# EAGLE schematic relay (EAGLE 6.4)
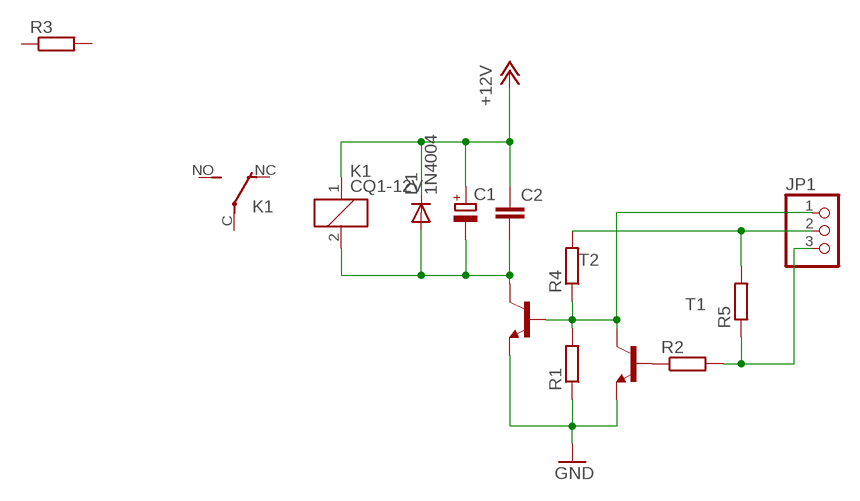
[diagram p0: schematic, sheet 1]

## Parts
C1  CPOL-EUE5-13  [E5-13]
C2  C-EU050-025X075  [C050-025X075]
D1  1N4004  [DO41-10]
JP1  PINHD-1X3  [1X03]
K1  CQ1-12V  [CQ1]
R1  R-EU_0207/10  [0207/10]
R2  R-EU_0207/10  [0207/10]
R3  R-EU_0207/10  [0207/10]
R4  R-EU_0207/10  [0207/10]
R5  R-EU_0207/10  [0207/10]
T1  -NPN-TO92  [TO92]
T2  -NPN-TO92  [TO92]

## Nets
+12V: C1.+ C2.1 D1.C K1.1
GND: R1.1 T1.1(E) T2.1(E)
N$1: JP1.2 R4.2 R5.2
N$2: C1.- C2.2 D1.A K1.2 T2.3(C)
N$3: R2.1 T1.2(B)
N$4: JP1.3 R2.2 R5.1
N$5: JP1.1 R1.2 R4.1 T1.3(C) T2.2(B)
Unconnected: K1.C(2:P) K1.NC(2:O) K1.NO(2:S) R3.1 R3.2

## Library data of the parts
C1 = rcl:CPOL-EU: POLARIZED CAPACITOR, European symbol
C2 = rcl:C-EU: CAPACITOR, European symbol
D1 = diode:1N4004: DIODE general purpose rectifier, 1 A
JP1 = pinhead:PINHD-1X3: PIN HEADER
K1 = relay:CQ1-12V: AUTOMOTIVE QUIET RELAY NAiS Source: http://www.mew-europe.com/.. en_ds_61208_0000.pdf; OC_FARNELL: unknown; OC_NEWARK: unknown
R1-R5 = rcl:R-EU_: RESISTOR, European symbol
T1 T2 = transistor:*-NPN-: NPN Transistror BF959 corrected 2008.03.06